# EAGLE design relayBoardSMD_RelayBottom (EAGLE 7.6.0)
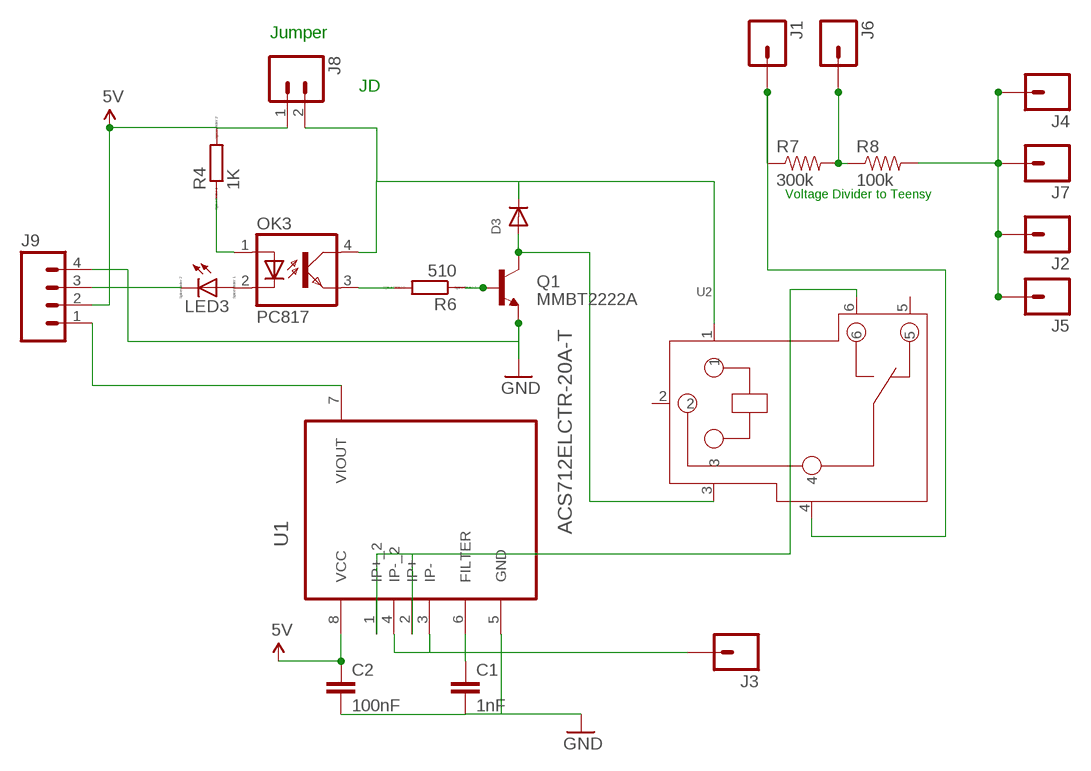
[diagram p0: schematic, sheet 1]

## Parts
C1  1nF  CAP1206  [1206]
C2  100nF  CAP1206  [1206]
D3  DIODEDO-1N4148  [DO-1N4148]
J1  M01NOSILK-KIT  [1X01NS-KIT]
J2  M01NOSILK-KIT  [1X01NS-KIT]
J3  M01NOSILK-KIT  [1X01NS-KIT]
J4  M01NOSILK-KIT  [1X01NS-KIT]
J5  M01NOSILK-KIT  [1X01NS-KIT]
J6  M01NOSILK-KIT  [1X01NS-KIT]
J7  M01NOSILK-KIT  [1X01NS-KIT]
J8  M02LOCK_LONGPADS  [1X02_LOCK_LONGPADS]
J9  M04LOCK_LONGPADS  [1X04_LOCK_LONGPADS]
LED3  LED_E  [LED_1206]
OK3  PC817  [DIL04]
Q1  MMBT2222A  TRANSISTOR_NPNMMBT2222A  [SOT23-3]
R4  1K  RR1206  [R1206]
R6  510  RR1206  [R1206]
R7  300k  RESISTOR1206  [1206]
R8  100k  RESISTOR1206  [1206]
U1  ACS712ELCTR-20A-T  [SOIC127P600X175-8N]
U2  RELAY-SLA-05VDC-SL-C  [6P-19.8H]

## Nets
5V: C2.1 J8.1 J9.2 R4.2 U1.8(VCC)
11.1V_BATTERY: J1.1 R7.1 U2.4
GND: C1.2 C2.2 J9.4 Q1.2(E) U1.5(GND)
GND_BATTERY: J2.1 J4.1 J5.1 J7.1 R8.2
N$19: LED3.A OK3.2(C)
N$20: OK3.1(A) R4.1
N$21: OK3.3(EMIT) R6.2
N$22: Q1.1(B) R6.1
N$23: D3.A Q1.3(C) U2.3
N$24: D3.C J8.2 OK3.4(COL) U2.1
N$26: J3.1 U1.3(IP-) U1.4(IP-_2)
N$27: J9.3 LED3.C
N$68: C1.1 U1.6(FILTER)
N$69: J9.1 U1.7(VIOUT)
N$70: U1.1(IP+_2) U1.2(IP+) U2.6
VOLTAGE_DIVIDER_5V: J6.1 R7.2 R8.1
Unconnected: U2.2 U2.5

## Notes on the sheet
- Jumper
- JD
- Voltage Divider to Teensy

## Library data of the parts
C1 C2 = SparkFun-Capacitors:CAP: Capacitor Standard 0603 ceramic capacitor, and 0.1" leaded capacitor.
D3 = adafruit:DIODE: Diode SMADIODE - SMA Surface Mount Package 20V 1A Schottky Diode Digikey: 641-1014-6-ND DO-1N4148 - Through Hole Small Current Diode SOD-123 20V 1 A (.5mV Vf) Schottky Diode - Digikey: MBRX120TPMSCT-ND SOD-323 10V 570mA (.38mV Vf, 3ns) Schottky Diode - Digikey: ZLLS410CT-ND SOD-523 30V 30mA Schottky Diode (RB751S-40TE61) - Digikey: RB751S-40TE61CT-ND SOT23-R/W - SOT23 Package (R = Solder Paste/Reflow Ovens, W = Hand-Soldering) BAT54Film 40V 300mA - Digikey: 497-7162-1-ND
J1-J7 = SparkFun-Connectors:M01: Header 1 Standard 1-pin 0.1" header. Use with straight break away headers (SKU : PRT-00116), right angle break away headers (PRT-00553), swiss pins (PRT-00743), machine pins (PRT-00117), and female headers (PRT-00115). SMTSO-256-ET is a "flush mount" nut for a 4-40 screw. The older package used to be too tight, and did not allow it to sit properly thru the drill hit. The latest (0.165DIA) fits nice and snug.
J8 = SparkFun-Connectors:M02: Standard 2-pin 0.1" header. Use with - straight break away headers ( PRT-00116) - right angle break away headers (PRT-00553) - swiss pins (PRT-00743) - machine pins (PRT-00117) - female headers (PRT-00115) Molex polarized connector foot print use with: PRT-08233 with associated crimp pins and housings. 2.54_SCREWTERM for use with PRT-10571. 3.5mm Screw Terminal footprints for PRT-08084 5mm Screw Terminal footprints for use with PRT-08432
J9 = SparkFun-Connectors:M04: Header 4 Standard 4-pin 0.1" header. Use with straight break away headers (SKU : PRT-00116), right angle break away headers (PRT-00553), swiss pins (PRT-00743), machine pins (PRT-00117), and female headers (PRT-00115). Molex polarized connector foot print use with SKU : PRT-08231 with associated crimp pins and housings. 1MM SMD Version SKU: PRT-10208; PROD_ID: CONN-09696
LED3 = eagle-ltspice:LED_E: LED Source: http://www.osram.convergy.de Source: www.luxeon.com Source: www.kingbright.com; SPICEMODEL: NONE; SPICEPREFIX: D; SPICETYPE: diode
OK3 = optocoupler:PC817: SHARP OPTO COUPLER; MPN: PC817X4J000F; OC_FARNELL: 9707727; OC_NEWARK: 97K7059
Q1 = SparkFun-DiscreteSemi:TRANSISTOR_NPN: Generic NPN BJT MMBT2222A - TRANS-08049 (SOT-23, 1A 40V) MPSA42 - TRANS-09116 (SOT-23, 500mA 300V) MMBT5088LT1G - TRANS-11160 (SOT-23, 50 mA 30V) BC547 - COM-08928 <http://www.sparkfun.com/products/8928> (TO-92 45V 100mA) (1.Collector 2.Base 3.Emitter) 2N3904 - COM-00521 <http://www.sparkfun.com/products/521> (TO-92 40V 200mA) (1.Emitter 2.Base 3.Collector) P2N2222A - COM-12852 <http://www.sparkfun.com/products/12852> (TO-92 40V 600mA) (1.Collector 2.Base 3.Emitter); PROD_ID: TRANS-08049
R4 R6 = eagle-ltspice:R: RESISTOR, European symbol; SPICEMODEL: NONE; SPICEPREFIX: R
R7 R8 = SparkFun-Passives:RESISTOR: Resistor Basic schematic elements and footprints for 0603, 1206, and PTH resistors.
U1 = Allegro_By_element14_Batch_1:ACS712ELCTR-20A-T: Linear Current Sensor; MPN: ACS712ELCTR-20A-T; OC_FARNELL: 1329624; OC_NEWARK: 31M3133; PACKAGE: SOIC-8; SUPPLIER: Allegro
U2 = Grove ®C SPDT Relay(30A) v1.0:RELAY-SLA-05VDC-SL-C: · Up to 30A switching in SPST and 20A switching in spot arrangements. · Available as an open-frame relay, with a snap-on dust cover or with an immersion cleanable, plastic sealed case.

## Board
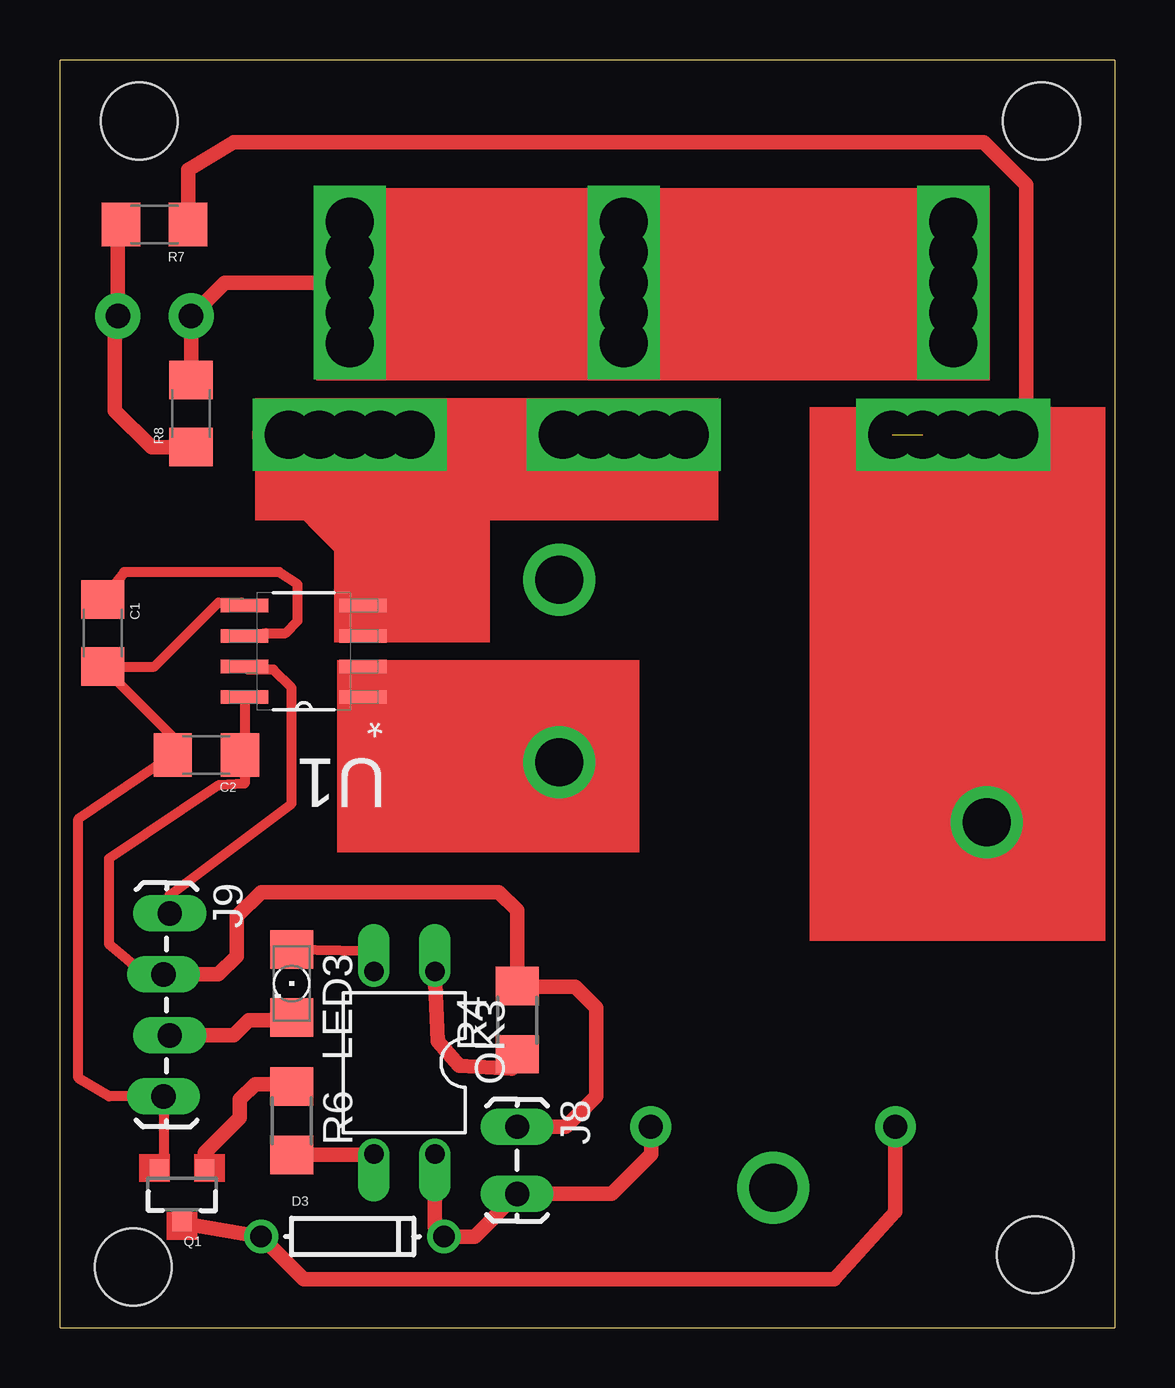
[diagram p1: board, top side]
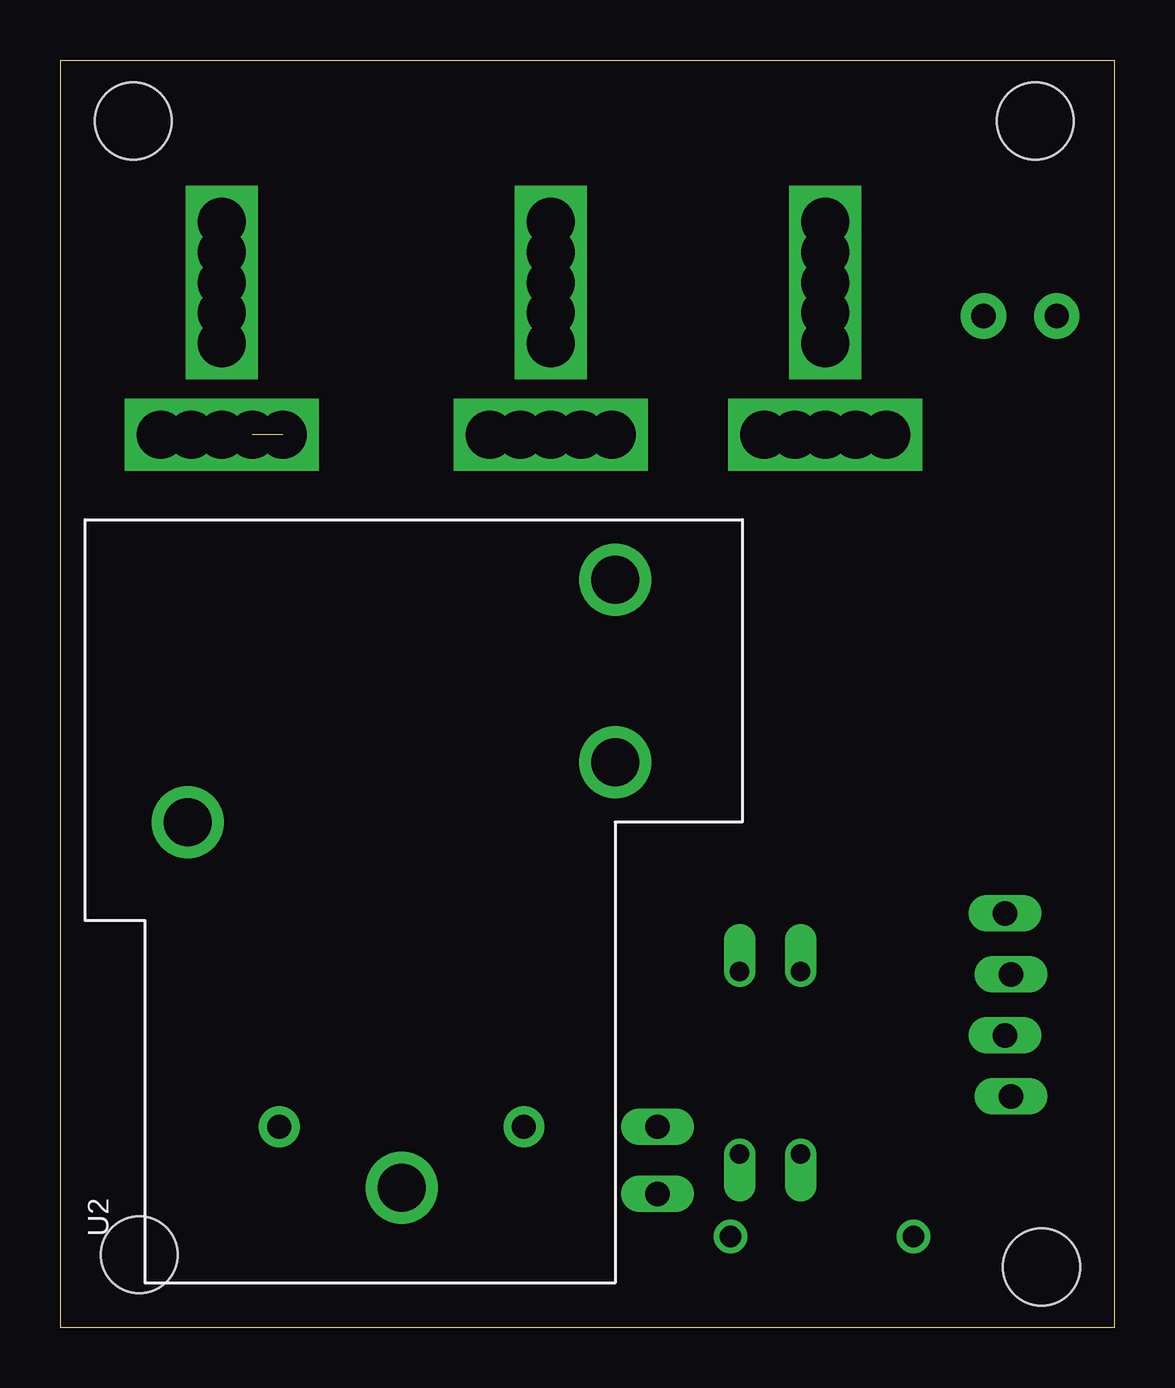
[diagram p2: board, bottom side, seen from below]

Size 43.94 x 52.83 mm. Coordinates in mm from the lower left corner, seen from the top.
Outline: 0,0 43.94,0 43.94,52.83 0,52.83 0,0
Copper layers (1*16): Top 0.035mm / dielectric 1.5mm / Bottom 0.035mm
Design rules "default": minimum track width 10mil, minimum drill 24mil, track to track 8mil, track to pad 8mil, pad to pad 8mil, via to via 8mil, smd to smd 8mil, copper to edge 40mil, drill to drill 8mil, minimum pad ring 10mil, minimum via ring 8mil, stop-mask expansion 4mil, vias tented up to drill 0mil, thermal gap 10mil
Holes 3.2 mm at 3.05,2.54 40.64,3.05 3.3,50.29 40.89,50.29

### Footprints (pad centres in the part's own frame; a part is rotated, then mirrored left to right if it is on the bottom)
1206 = smd 1.6 x 1.8: 1 -1.4,0; 2 1.4,0
DO-1N4148 = drill 0.9: A -3.81,0; C 3.81,0
1X01NS-KIT = drill 1.016 pad 1.88: 1 0,0
1X02_LOCK_LONGPADS = drill 1.016 long: 1 -0.127,0; 2 2.667,0
1X04_LOCK_LONGPADS = drill 1.016 long: 1 0,0; 2 2.54,-0.254; 3 5.08,0; 4 7.62,-0.254
LED_1206 = smd 1.6 x 1.803: A -1.422,0; C 1.422,0
DIL04 = drill 0.813 offset: 1 -1.27,-3.81; 2 1.27,-3.81; 3 1.27,3.81; 4 -1.27,3.81
SOT23-3 = smd 0.8 x 0.9: 1 -0.95,-1; 2 0.95,-1; 3 0,1.1
R1206 = smd 1.6 x 1.803: 1 -1.422,0; 2 1.422,0
SOIC127P600X175-8N = smd 1.981 x 0.559: 1 -2.464,1.905; 2 -2.464,0.635; 3 -2.464,-0.635; 4 -2.464,-1.905; 5 2.464,-1.905; 6 2.464,-0.635; 7 2.464,0.635; 8 2.464,1.905
6P-19.8H = drill 1 pad 1.7: 1 -9.4,-4.6; 3 -9.4,5.6 | drill 2 pad 3: 2 -11.94,0.5; 4 3.3,9.4; 5 13.4,-8.4; 6 5.8,-8.4

### Placement (x,y rotation side)
C1  1.78,28.96 270 top
C2  6.1,23.88 180 top
D3  12.19,3.81 0 top
J1  39.75,37.21 90 top
J2  23.5,43.56 270 top
J3  20.96,37.21 0 top
J4  5.46,42.16 0 top
J5  37.21,43.38 0 top
J6  2.41,42.16 0 top
J7  12.07,43.56 270 top
J8  19.05,8.25 270 top
J9  4.57,17.27 270 top
LED3  9.65,14.35 270 top
OK3  14.35,11.05 180 top
Q1  5.08,5.59 180 top
R4  19.05,12.83 90 top
R6  9.65,8.64 270 top
R7  3.94,45.97 180 top
R8  5.46,38.1 90 top
U1  10.16,28.19 180 top
U2  29.21,17.78 90 bottom

### Tracks (layer width: path | path; a pad name or v marks a point on that pad's centre or on a via)
5V
  Top 0.406: U1.8 7.7,24.33 | 7.7,24.33 C2.1 | 7.7,24.33 7.7,22.68 6.6,22.61 2.03,19.56 2.03,16 3.56,14.73 J9.2
  Top 0.61: J8.1 21.08,8.38 22.35,9.65 22.35,13.33 21.46,14.22 19.08,14.22 R4.2 19.05,17.4 18.29,18.16 8.38,18.16 7.37,17.14 7.37,15.49 6.6,14.73 J9.2
11.1V_BATTERY
  Top 0.406: U2.4 38.61,36.07 J1.1
  Top 0.61: R7.1 5.34,48.26 7.24,49.4 38.48,49.4 40.26,47.62 40.26,37.72 J1.1
GND
  Top 0.406: Q1.2 4.32,6.78 J9.4 2.03,9.65 0.76,10.41 0.76,21.21 C2.2 4.7,24.64 C1.2 3.93,27.56 6.6,30.23 7.57,30.23 U1.5
GND_BATTERY
  Top 0.61: J7.1 6.86,43.56 J4.1 R8.2
  Top 2.54: J7.1 J2.1 36.45,43.56 J5.1
N$2  (via drill 2)
  other vias: 26.03,37.21
N$3  (via drill 2)
  other vias: 24.77,37.21
N$4  (via drill 2)
  other vias: 23.5,37.21
N$5  (via drill 2)
  other vias: 22.23,37.21
N$6  (via drill 2)
  other vias: 20.96,37.21
N$7  (via drill 2)
  other vias: 23.5,41.02
N$8  (via drill 2)
  other vias: 23.5,42.29
N$9  (via drill 2)
  other vias: 23.5,43.56
N$10  (via drill 2)
  other vias: 23.5,44.83
N$11  (via drill 2)
  other vias: 23.5,46.1
N$12  (via drill 2)
  other vias: 14.61,37.21
N$13  (via drill 2)
  other vias: 13.34,37.21
N$14  (via drill 2)
  other vias: 12.07,37.21
N$15  (via drill 2)
  other vias: 10.8,37.21
N$16  (via drill 2)
  other vias: 9.53,37.21
N$17  (via drill 2)
  other vias: 12.07,41.02
N$18  (via drill 2)
  other vias: 12.07,42.29
N$19
  Top 0.406: LED3.A 12.73,15.72 OK3.2
N$20
  Top 0.61: OK3.1 15.75,11.94 16.64,10.92 18.82,10.79 R4.1
N$21
  Top 0.61: R6.2 13.06,7.21 OK3.3
N$22
  Top 0.61: Q1.1 6.03,7.3 7.49,8.76 7.49,9.53 8.13,10.16 9.55,10.16 R6.1
N$23
  Top 0.61: Q1.3 5.33,4.32 D3.A 10.16,2.03 32.26,2.03 34.81,4.84 U2.3
N$24
  Top 0.61: OK3.4 15.62,4.19 D3.C 17.27,3.81 J8.2 22.99,5.59 24.64,7.24 24.64,8.35 U2.1
N$26
  Top 0.406: U1.3 12.62,29.59 U1.4
  Top 1.676: 9.27,37.21 9.27,35.69 12.57,32.39 12.57,29.64 12.62,29.59
  Top 2.54: 9.27,37.21 J3.1
N$27
  Top 0.61: J9.3 7.24,12.19 7.87,12.83 9.55,12.83 LED3.C
N$29  (via drill 2)
  other vias: 12.07,43.56
N$30  (via drill 2)
  other vias: 12.07,44.83
N$51  (via drill 2)
  other vias: 39.75,37.21
N$52  (via drill 2)
  other vias: 38.48,37.21
N$53  (via drill 2)
  other vias: 37.21,37.21
N$54  (via drill 2)  (1 unrouted)
  other vias: 35.94,37.21 34.67,37.21
N$56  (via drill 2)
  other vias: 37.21,41.02
N$57  (via drill 2)
  other vias: 37.21,42.29
N$58  (via drill 2)
  other vias: 37.21,43.56
N$59  (via drill 2)
  other vias: 37.21,44.83
N$60  (via drill 2)
  other vias: 37.21,46.1
N$62  (via drill 2)
  other vias: 12.07,46.1
N$68
  Top 0.406: 1.91,30.6 C1.1 2.67,31.5 9.14,31.5 9.91,30.99 9.91,29.46 9.4,28.96 8.59,28.96 U1.6
N$69
  Top 0.406: J9.1 4.57,18.03 9.65,21.84 9.65,26.67 8.89,27.43 7.82,27.43 U1.7
N$70
  Top 0.406: U1.2 U1.1 15.33,23.58 U2.6
VOLTAGE_DIVIDER_5V
  Top 0.61: R8.1 3.81,36.7 2.29,38.23 2.29,42.04 J6.1 2.41,45.85 R7.2
(copper drawn outside any net)
  shapes: Top area x9